# EAGLE design Hallstop (EAGLE 9.6.2)
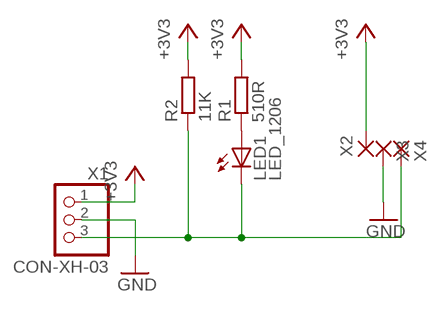
[diagram p0: schematic, sheet 1]

## Parts
LED1  LED_1206  [LED1206]
R1  510R  R_0805  [R0805]
R2  11K  R_0805  [R0805]
X1  CON-XH-03  [XH-03]
X2  WIREPAD-SMD2  [PAD-1.27X2.54]
X3  WIREPAD-SMD2  [PAD-1.27X2.54]
X4  WIREPAD-SMD2  [PAD-1.27X2.54]

## Nets
+3V3: R1.2 R2.2 X1.1 X2.P$1(P)
GND: X1.2 X3.P$1(P)
N$1: LED1.A R1.1
N$2: LED1.C R2.1 X1.3 X4.P$1(P)

## Library data of the parts
LED1 = Flamberm:LED_
R1 R2 = Namenlos:R_
X1 = Flamberm:CON-XH-03
X2-X4 = Flamberm:WIREPAD-SMD2: SMD PAD

## Board
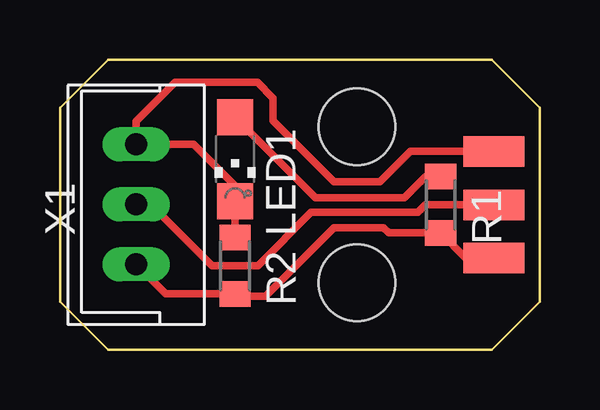
[diagram p1: board, top side]

Size 20 x 12.06 mm. Coordinates in mm from the lower left corner, seen from the top.
Outline: 0,2 0,10.06 2,12.06 18,12.06 20,10.06 20,2 18,0 2,0 0,2
Copper layers (1*16): Top 0.035mm / dielectric 1mm / Bottom 0.035mm
Design rules "EagleDesignRules *": minimum track width 0.25mm, minimum drill 0.3mm, track to track 0.25mm, track to pad 0.25mm, pad to pad 0.25mm, via to via 0.25mm, smd to smd 0.25mm, copper to edge 0.5mm, drill to drill 0.5mm, minimum pad ring 10mil, minimum via ring 8mil, stop-mask expansion 4mil, vias tented up to drill 0mil, thermal gap 0.25mm
Holes 3.2 mm at 12.38,9.28 12.38,2.78

### Footprints (pad centres in the part's own frame; a part is rotated, then mirrored left to right if it is on the bottom)
LED1206 = smd 1.5 x 1.5: A 0,-1.75; C 0,1.75
R0805 = smd 1.05 x 1.3: 1 -1.175,0; 2 1.175,0
XH-03 = drill 0.9 long: 1 -2.48,0; 2 0.02,0; 3 2.52,0
PAD-1.27X2.54 = smd 2.54 x 1.27: P$1 0,0

### Placement (x,y rotation side)
LED1  7.3,7.94 180 top
R1  15.88,6.03 270 top
R2  7.3,3.49 270 top
X1  3.17,6.03 90 top
X2  18.1,3.81 0 top
X3  18.1,6.03 0 top
X4  18.1,8.25 0 top

### Tracks (layer width: path | path; a pad name or v marks a point on that pad's centre or on a via)
+3V3
  Top 0.305: X1.1 4.41,2.32 R2.2 | X2.P$1 16.92,3.81 R1.2 13.71,4.86 13.49,5.08 11.43,5.08 8.57,2.22 7.4,2.22
  Top 0.61: 7.4,2.22 R2.2
GND
  Top 0.305: X3.P$1 15.24,6.03 14.92,5.71 10.48,5.71 8.25,3.49 6.35,3.49 3.79,6.05
  Top 0.61: 3.79,6.05 X1.2
N$1
  Top 0.305: R1.1 15.24,7.21 14.37,6.33 10.66,6.33 LED1.A
N$2
  Top 0.305: R2.1 LED1.C 7.3,6.82 5.57,8.55 X1.3 3.17,9.51 4.8,11.13 8.24,11.13 8.89,10.48 8.89,9.53 11.43,6.99 13.33,6.99 14.6,8.26 X4.P$1